# Altium schematic sheet 单片机电路原理图.SCHDOC
size A3
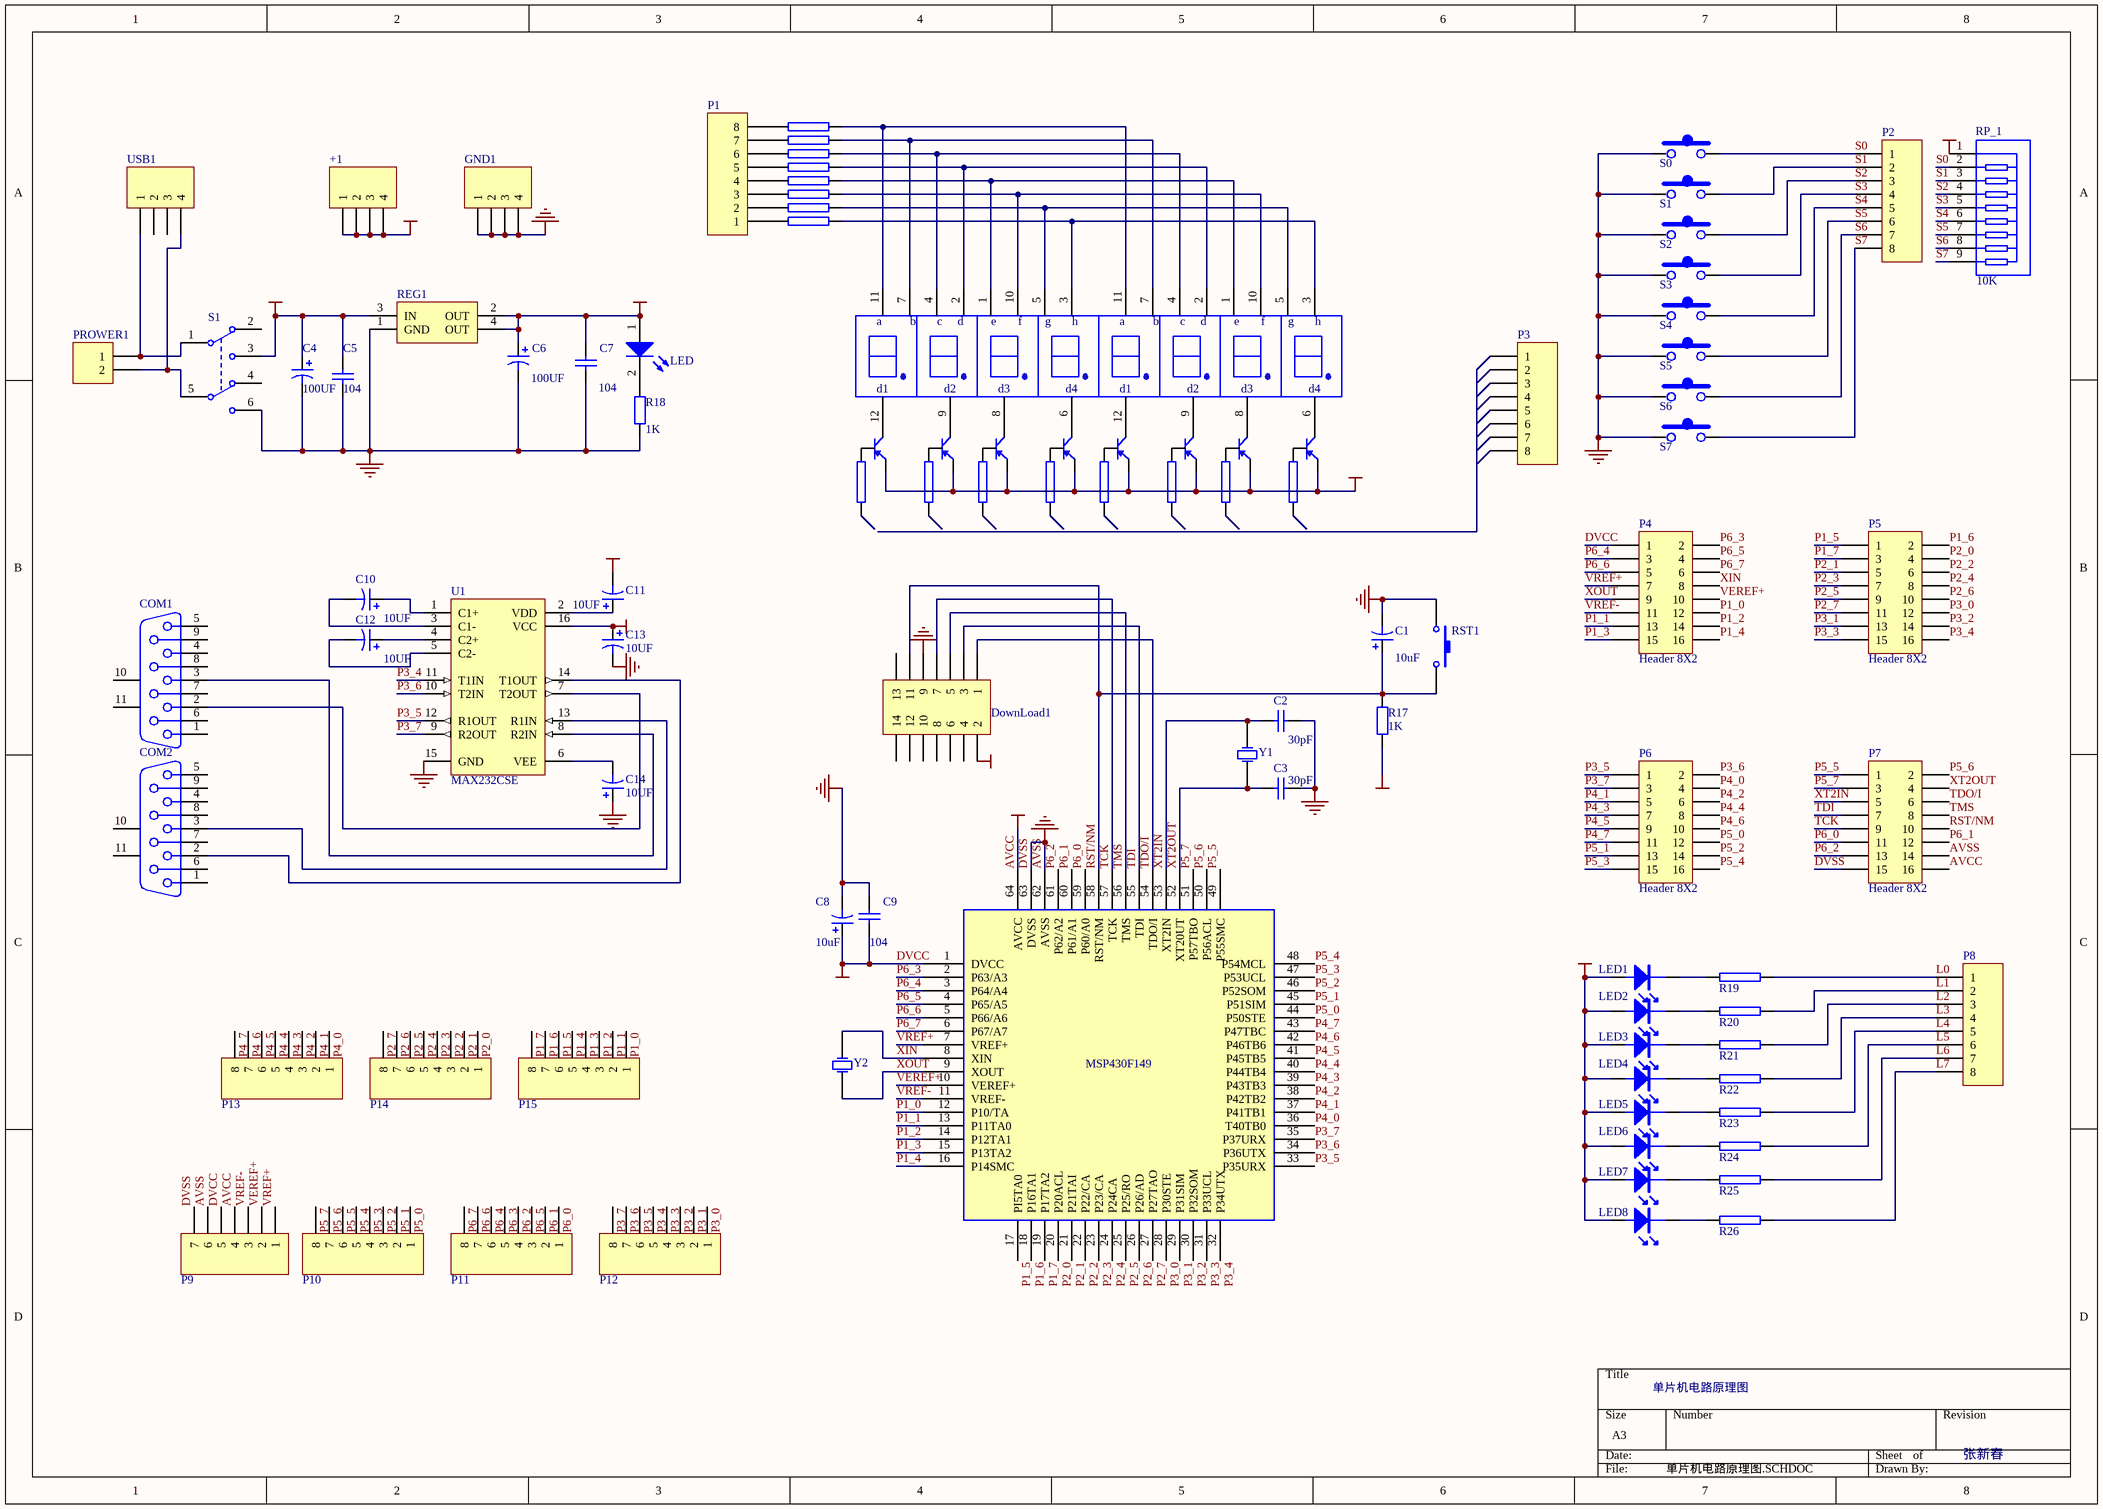
[diagram p0: 单片机电路原理图.SCHDOC]

## Parts
1  S0  [an-6*6]
2  S1  [an-6*6]
3  S2  [an-6*6]
4  LED8  [LED8PF]  (value not drawn)
5  LED8  [LED8PF]  (value not drawn)
6  S3  [an-6*6]
7  S4  [an-6*6]
8  S5  [an-6*6]
9  NPN1  [NPN1PF]  (value not drawn)
10  2  [NPN1PF]  (value not drawn)
11  3  [NPN1PF]  (value not drawn)
12  NPN1  [NPN1PF]  (value not drawn)
13  NPN1  [NPN1PF]  (value not drawn)
14  NPN1  [NPN1PF]  (value not drawn)
15  NPN1  [NPN1PF]  (value not drawn)
16  NPN1  [NPN1PF]  (value not drawn)
17  S6  [an-6*6]
18  S7  [an-6*6]
+1  Header 4  [HDR1X4]  (value not drawn)
C1  value 10uF  [C-DJ-4]  (hidden comment: Cap Pol1)
C2  value 30pF  [CPDR]  (hidden comment: CPDR)
C3  value 30pF  [CPDR]  (hidden comment: CPDR)
C4  value 100UF  [C-DJ-6]  (hidden comment: Cap Pol1)
C5  value 104  [CPDR]  (hidden comment: Cap Semi)
C6  value 100UF  [C-DJ-4]  (hidden comment: Cap Pol1)
C7  value 104  [CPDR]  (hidden comment: Cap Semi)
C8  value 10uF  [C-DJ-4]  (hidden comment: Cap Pol1)
C9  value 104  [CPDR]  (hidden comment: Cap Semi)
C10  value 10UF  [C-DJ-4]  (hidden comment: Cap Pol1)
C11  value 10UF  [C-DJ-4]  (hidden comment: Cap Pol1)
C12  value 10UF  [C-DJ-4]  (hidden comment: Cap Pol1)
C13  value 10UF  [C-DJ-4]  (hidden comment: Cap Pol1)
C14  value 10UF  [C-DJ-4]  (hidden comment: Cap Pol1)
COM1  D Connector 9  [COM-9]  (value not drawn)
COM2  D Connector 9  [COM-9]  (value not drawn)
DownLoad1  Header 7X2  [HDR-2X7]  (value not drawn)
DS1  LED  [LED]
GND1  Header 4  [HDR1X4]  (value not drawn)
LED1  LED  [TP-0805-D]  (value not drawn)
LED2  LED  [TP-0805-D]  (value not drawn)
LED3  LED  [TP-0805-D]  (value not drawn)
LED4  LED  [TP-0805-D]  (value not drawn)
LED5  LED  [TP-0805-D]  (value not drawn)
LED6  LED  [TP-0805-D]  (value not drawn)
LED7  LED  [TP-0805-D]  (value not drawn)
LED8  LED  [TP-0805-D]  (value not drawn)
MSP1  MSP430F149  [MPS430149]
P1  Header 8  [HDR1X8]  (value not drawn)
P2  PZ_8  [HDR-8]  (value not drawn)
P3  Header 8  [HDR1X8]  (value not drawn)
P4  Header 8X2  [HDR2X8]
P5  Header 8X2  [HDR2X8]
P6  Header 8X2  [HDR2X8]
P7  Header 8X2  [HDR2X8]
P8  PZ_8  [HDR-8]  (value not drawn)
P9  Header 7  [HDR1X7]  (value not drawn)
P10  Header 8  [HD-8]  (value not drawn)
P11  Header 8  [HD-8]  (value not drawn)
P12  Header 8  [HD-8]  (value not drawn)
P13  Header 8  [HD-8]  (value not drawn)
P14  Header 8  [HD-8]  (value not drawn)
P15  Header 8  [HDR-8]  (value not drawn)
PROWER1  PZ_2  [JK128_2]  (value not drawn)
R1  RES1  [RES1PF]  (value not drawn)
R2  RES1  [RES1PF]  (value not drawn)
R3  RES1  [RES1PF]  (value not drawn)
R4  RES1  [RES1PF]  (value not drawn)
R5  RES1  [RES1PF]  (value not drawn)
R6  RES1  [RES1PF]  (value not drawn)
R7  RES1  [RES1PF]  (value not drawn)
R8  RES1  [RES1PF]  (value not drawn)
R9  RES1  [RES1PF]  (value not drawn)
R10  RES1  [RES1PF]  (value not drawn)
R11  RES1  [RES1PF]  (value not drawn)
R12  RES1  [RES1PF]  (value not drawn)
R13  RES1  [RES1PF]  (value not drawn)
R14  RES1  [RES1PF]  (value not drawn)
R15  RES1  [RES1PF]  (value not drawn)
R16  RES1  [RES1PF]  (value not drawn)
R17  value 1K  [TP-0805-R]  (hidden comment: Res)
R18  value 1K  [TP-0805-R]  (hidden comment: Res)
R19  RES1  [TP-0805-R]  (value not drawn)
R20  RES1  [TP-0805-R]  (value not drawn)
R21  RES1  [TP-0805-R]  (value not drawn)
R22  RES1  [TP-0805-R]  (value not drawn)
R23  RES1  [TP-0805-R]  (value not drawn)
R24  RES1  [TP-0805-R]  (value not drawn)
R25  RES1  [TP-0805-R]  (value not drawn)
R26  RES1  [TP-0805-R]  (value not drawn)
REG1  REG1117-3.3  [ZZ311]  (value not drawn)
RP_1  value 10K  [HDR-10]  (hidden comment: Res PZ_8)
RST1  AJKG  [an-6*6]  (value not drawn)
S1  ZSKG_KEY  [DPDT-6]  (value not drawn)
U1  MAX232CSE  [DIP-16]
USB1  PZ_4  [USB-5V]  (value not drawn)
Y1  XTAL  [JZ_ZC]  (value not drawn)
Y2  XTAL  [BCY-W2/D3.1]  (value not drawn)

## Nets
+5V: +1.1 +1.2 +1.3 +1.4 C4.1 C5.2 C11.2 C13.1 REG1.3(IN) S1.3(NO1) U1.16(VCC)
AVCC: 9.e 10.e 11.e 12.e 13.e 14.e 15.e 16.e C6.1 C7.2 C8.1 C9.1 DownLoad1.2 DS1.1(A) LED1.1(A) LED2.1(A) LED3.1(A) LED4.1(A) LED5.1(A) LED6.1(A) LED7.1(A) LED8.1(A) MSP1.1(DVCC) MSP1.64(AVCC) P4.1 P7.16 P9.4 P9.5 R17.1 REG1.2(OUT) REG1.4(OUT) RP_1.1  [also labelled DVCC, VCC]
AVSS: 1.1 2.1 3.1 6.1 7.1 8.1 17.1 18.1 C1.2 C2.2 C3.2 C4.2 C5.1 C6.2 C7.1 C8.2 C9.2 C13.2 C14.1 DownLoad1.9 GND1.1 GND1.2 GND1.3 GND1.4 MSP1.62(AVSS) MSP1.63(DVSS) P7.14 P7.15 P9.6 P9.7 R18.1 REG1.1(GND) RST1.1 S1.6(NO2) U1.15(GND)  [also labelled DVSS, GND]
L0: P8.1 R19.1
L1: P8.2 R20.1
L2: P8.3 R21.1
L3: P8.4 R22.1
L4: P8.5 R23.1
L5: P8.6 R24.1
L6: P8.7 R25.1
L7: P8.8 R26.1
P1_0: MSP1.12(P10/TA) P4.12 P15.1
P1_1: MSP1.13(P11TA0) P4.13 P15.2
P1_2: MSP1.14(P12TA1) P4.14 P15.3
P1_3: MSP1.15(P13TA2) P4.15 P15.4
P1_4: MSP1.16(P14SMC) P4.16 P15.5
P1_5: MSP1.17(PI5TA0) P5.1 P15.6
P1_6: MSP1.18(P16TA1) P5.2 P15.7
P1_7: MSP1.19(P17TA2) P5.3 P15.8
P2_0: MSP1.20(P20ACL) P5.4 P14.1
P2_1: MSP1.21(P21TAI) P5.5 P14.2
P2_2: MSP1.22(P22/CA) P5.6 P14.3
P2_3: MSP1.23(P23/CA) P5.7 P14.4
P2_4: MSP1.24(P24CA) P5.8 P14.5
P2_5: MSP1.25(P25/RO) P5.9 P14.6
P2_6: MSP1.26(P26/AD) P5.10 P14.7
P2_7: MSP1.27(P27TAO) P5.11 P14.8
P3_0: MSP1.28(P30STE) P5.12 P12.1
P3_1: MSP1.29(P31SIM) P5.13 P12.2
P3_2: MSP1.30(P32SOM) P5.14 P12.3
P3_3: MSP1.31(P33UCL) P5.15 P12.4
P3_4: MSP1.32(P34UTX) P5.16 P12.5 U1.11(T1IN)
P3_5: MSP1.33(P35URX) P6.1 P12.6 U1.12(R1OUT)
P3_6: MSP1.34(P36UTX) P6.2 P12.7 U1.10(T2IN)
P3_7: MSP1.35(P37URX) P6.3 P12.8 U1.9(R2OUT)
P4_0: MSP1.36(T40TB0) P6.4 P13.1
P4_1: MSP1.37(P41TB1) P6.5 P13.2
P4_2: MSP1.38(P42TB2) P6.6 P13.3
P4_3: MSP1.39(P43TB3) P6.7 P13.4
P4_4: MSP1.40(P44TB4) P6.8 P13.5
P4_5: MSP1.41(P45TB5) P6.9 P13.6
P4_6: MSP1.42(P46TB6) P6.10 P13.7
P4_7: MSP1.43(P47TBC) P6.11 P13.8
P5_0: MSP1.44(P50STE) P6.12 P10.1
P5_1: MSP1.45(P51SIM) P6.13 P10.2
P5_2: MSP1.46(P52SOM) P6.14 P10.3
P5_3: MSP1.47(P53UCL) P6.15 P10.4
P5_4: MSP1.48(P54MCL) P6.16 P10.5
P5_5: MSP1.49(P55SMC) P7.1 P10.6
P5_6: MSP1.50(P56ACL) P7.2 P10.7
P5_7: MSP1.51(P57TBO) P7.3 P10.8
P6_0: MSP1.59(P60/A0) P7.11 P11.1
P6_1: MSP1.60(P61/A1) P7.12 P11.2
P6_2: MSP1.61(P62/A2) P7.13 P11.4
P6_3: MSP1.2(P63/A3) P4.2 P11.5
P6_4: MSP1.3(P64/A4) P4.3 P11.6
P6_5: MSP1.4(P65/A5) P4.4 P11.3
P6_6: MSP1.5(P66/A6) P4.5 P11.7
P6_7: MSP1.6(P67/A7) P4.6 P11.8
RST/NM: C1.1 DownLoad1.11 MSP1.58(RST/NM) P7.10 R17.2 RST1.2
S0: 1.2 P2.1 RP_1.2
S1: 2.2 P2.2 RP_1.3
S2: 3.2 P2.3 RP_1.4
S3: 6.2 P2.4 RP_1.5
S4: 7.2 P2.5 RP_1.6
S5: 8.2 P2.6 RP_1.7
S6: 17.2 P2.7 RP_1.8
S7: 18.2 P2.8 RP_1.9
TCK: DownLoad1.7 MSP1.57(TCK) P7.9
TDI: DownLoad1.3 MSP1.55(TDI) P7.7
TDO/I: DownLoad1.1 MSP1.54(TDO/I) P7.6
TMS: DownLoad1.5 MSP1.56(TMS) P7.8
VEREF+: MSP1.10(VEREF+) P4.10 P9.2
VREF+: MSP1.7(VREF+) P4.7 P9.1
VREF-: MSP1.11(VREF-) P4.11 P9.3
XIN: MSP1.8(XIN) P4.8 Y2.1(OSC1)
XOUT: MSP1.9(XOUT) P4.9 Y2.2(OSC2)
XT2IN: C2.1 MSP1.53(XT2IN) P7.5 Y1.2(OSC2)
XT2OUT: C3.1 MSP1.52(XT20UT) P7.4 Y1.1(OSC1)
Net4_1: 4.1 5.1 R5.2
Net4_2: 4.2 5.2 R4.2
Net4_3: 4.3 5.3 R8.2
Net4_4: 4.4 5.4 R3.2
Net4_5: 4.5 5.5 R7.2
Net4_6: 4.6 12.c
Net4_7: 4.7 5.7 R2.2
Net4_8: 4.8 11.c
Net4_9: 4.9 10.c
Net4_10: 4.10 5.10 R6.2
Net4_11: 4.11 5.11 R1.2
Net4_12: 4.12(d1) 9.c
Net5_6: 5.6 16.c
Net5_8: 5.8 15.c
Net5_9: 5.9 14.c
Net5_12: 5.12(d1) 13.c
Net9_b: 9.b R9.2
Net10_b: 10.b R10.2
Net11_b: 11.b R16.2
Net12_b: 12.b R11.2
Net13_b: 13.b R12.2
Net14_b: 14.b R13.2
Net15_b: 15.b R14.2
Net16_b: 16.b R15.2
NetC10_1: C10.1 U1.1(C1+)
NetC10_2: C10.2 U1.3(C1-)
NetC11_1: C11.1 U1.2(VDD)
NetC12_1: C12.1 U1.4(C2+)
NetC12_2: C12.2 U1.5(C2-)
NetC14_2: C14.2 U1.6(VEE)
NetCOM1_2: COM1.2 U1.7(T2OUT)
NetCOM1_3: COM1.3 U1.8(R2IN)
NetCOM2_2: COM2.2 U1.14(T1OUT)
NetCOM2_3: COM2.3 U1.13(R1IN)
NetDS1_2: DS1.2(K) R18.2
NetLED1_2: LED1.2(K) R19.2
NetLED2_2: LED2.2(K) R20.2
NetLED3_2: LED3.2(K) R21.2
NetLED4_2: LED4.2(K) R22.2
NetLED5_2: LED5.2(K) R23.2
NetLED6_2: LED6.2(K) R24.2
NetLED7_2: LED7.2(K) R25.2
NetLED8_2: LED8.2(K) R26.2
NetP1_1: P1.1 R8.1
NetP1_2: P1.2 R7.1
NetP1_3: P1.3 R6.1
NetP1_4: P1.4 R5.1
NetP1_5: P1.5 R4.1
NetP1_6: P1.6 R3.1
NetP1_7: P1.7 R2.1
NetP1_8: P1.8 R1.1
NetPROWER1_1: PROWER1.1 S1.1(COMMON1) USB1.1
NetPROWER1_2: PROWER1.2 S1.5(COMMON2) USB1.4

Not connected (* = marked no-connect by the designer): COM1 1 4 5 6 7 8 9 10(MH1) 11(MH2); COM2 1 4 5 6 7 8 9 10(MH1) 11(MH2); DownLoad1 4 6 8 10 12 13 14; P3 1 2 3 4 5 6 7 8; R9 1; R10 1; R11 1; R12 1; R13 1; R14 1; R15 1; R16 1; S1 2(NC1) 4(NC2); USB1 2 3

## Notes on the sheet
- 单片机电路原理图
- 张新春
- (in symbol LED8) a; b; c; d; e; f; g; h; d2; d3; d4

## Library data of the parts
1-3 6-8 17 18 = KEY
10 11 = NPN1
+1 GND1 = Header 4: Header, 4-Pin; LatestRevisionDate: 17-Jul-2002; LatestRevisionNote: Re-released for DXP Platform.; Publisher: Altium Limited
C1 C4 C6 C8 C10-C14 = Cap Pol1: Polarized Capacitor (Radial); Published: 8-Jun-2000; LatestRevisionDate: 17-Jul-2002; LatestRevisionNote: Re-released for DXP Platform.; Publisher: Altium Limited
C2 C3 = CPDR: 瓷片电容; Published: 8-Jun-2000; LatestRevisionDate: 17-Jul-2002; LatestRevisionNote: Re-released for DXP Platform.; Publisher: Altium Limited
C5 C7 C9 = Cap Semi: Capacitor (Semiconductor SIM Model); Published: 8-Jun-2000; LatestRevisionDate: 17-Jul-2002; LatestRevisionNote: Re-released for DXP Platform.; PackageReference: C1206; Publisher: Altium Limited
COM1 COM2 = D Connector 9: Receptacle Assembly, 9 Position, Right Angle; PackageDocument: O; Positions: 9; Published: 15-Jun-2001; LatestRevisionDate: 17-Jul-2002; LatestRevisionNote: Re-released for DXP Platform.; DatasheetDocument: 1-Sep-1999; PackageReference: 788750; Publisher: Altium Limited; Orientation: Right Angle; Gender: Receptacle
DownLoad1 = Header 7X2: Header, 7-Pin, Dual row; LatestRevisionDate: 17-Jul-2002; LatestRevisionNote: Re-released for DXP Platform.; Publisher: Altium Limited
DS1 = LED: 发光二极管; Published: 8-Jun-2000; LatestRevisionDate: 17-Jul-2002; LatestRevisionNote: Re-released for DXP Platform.; Publisher: Altium Limited
MSP1 = MSP430F133
P1 P3 P10-P15 = Header 8: Header, 8-Pin; LatestRevisionDate: 17-Jul-2002; LatestRevisionNote: Re-released for DXP Platform.; Publisher: Altium Limited
P2 P8 = PZ_8: 排针——8; LatestRevisionDate: 17-Jul-2002; LatestRevisionNote: Re-released for DXP Platform.; Publisher: Altium Limited
P4-P7 = Header 8X2: Header, 8-Pin, Dual row; LatestRevisionDate: 17-Jul-2002; LatestRevisionNote: Re-released for DXP Platform.; Publisher: Altium Limited
P9 = Header 7: Header, 7-Pin; LatestRevisionDate: 17-Jul-2002; LatestRevisionNote: Re-released for DXP Platform.; Publisher: Altium Limited
PROWER1 = PZ_2: 排针——2; LatestRevisionDate: 17-Jul-2002; LatestRevisionNote: Re-released for DXP Platform.; Publisher: Altium Limited
R17 R18 = Res: 电阻; Published: 8-Jun-2000; LatestRevisionDate: 17-Jul-2002; LatestRevisionNote: Re-released for DXP Platform.; Publisher: Altium Limited
REG1 = REG1117-3.3: 800mA and 1A Low Dropout Positive Regulator 2.85V, 3.3V, 5V, and Adjustable; PackageDocument: revC; Published: 8-Jun-2000; LatestRevisionDate: 17-Jul-2002; LatestRevisionNote: Re-released for DXP Platform.; DatasheetDocument: Sep-1997; PackageReference: ZZ311; Publisher: Altium Limited
RP_1 = Res PZ_8: 8位排阻; Published: 24-Mar-1999; LatestRevisionDate: 17-Jul-2002; LatestRevisionNote: Re-released for DXP Platform.; Publisher: Altium Limited; Code_JEDEC: MO-150-AC
RST1 = AJKG: 按键开关; Published: 24-Mar-1999; LatestRevisionDate: 17-Jul-2002; LatestRevisionNote: Re-released for DXP Platform.; Publisher: Altium Limited
S1 = ZSKG_KEY: 自锁开关; Published: 24-Mar-1999; LatestRevisionDate: 17-Jul-2002; LatestRevisionNote: Re-released for DXP Platform.; Publisher: Altium Limited
U1 = MAX232CSE: +5V Powered, Multi-Channel RS-232 Driver/Receiver; Code - JEDEC: MS-012-AC; Code - IPC: SO16; Published: 16-Jan-2001; Revision: 17-Jul-2002: Re-released for DXP Platform.; Package Reference: NSO16; Publisher: Altium Limited
USB1 = PZ_4: 排针——4; LatestRevisionDate: 17-Jul-2002; LatestRevisionNote: Re-released for DXP Platform.; Publisher: Altium Limited
Y1 Y2 = XTAL: Crystal Oscillator; Published: 8-Jun-2000; LatestRevisionDate: 17-Jul-2002; LatestRevisionNote: Re-released for DXP Platform.; Publisher: Altium Limited